# Altium schematic sheet powersupply.SchDoc
size A4
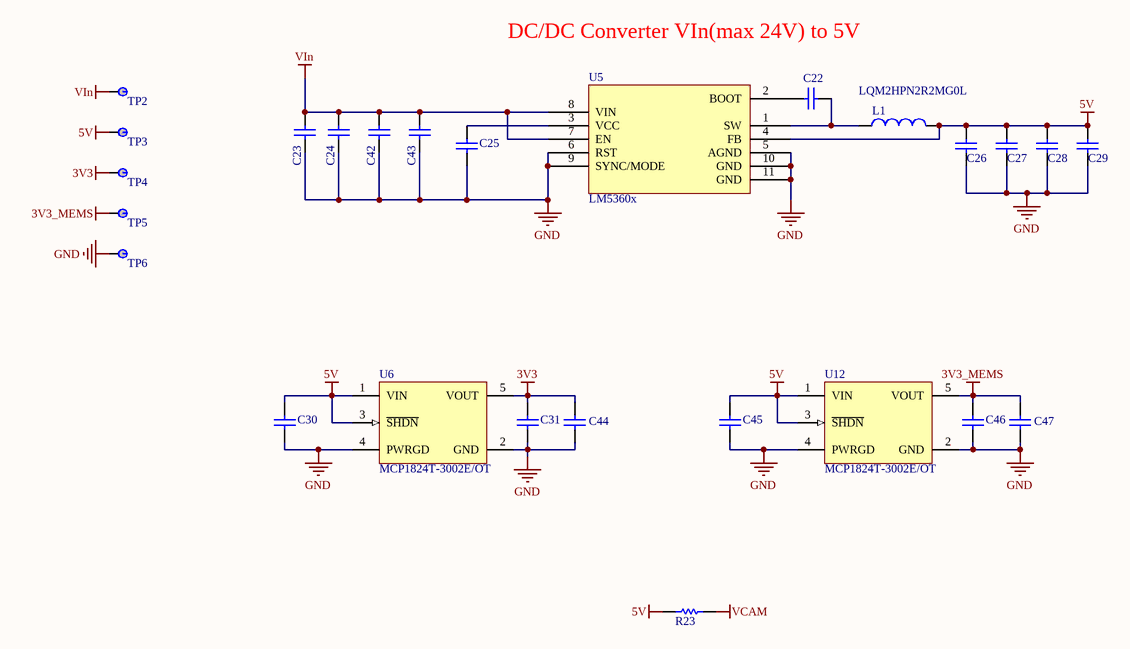
[diagram p0: powersupply.SchDoc]

## Parts
C22  CAP 100nF 50V 0805(2012)  [CAPC0805(2012)100_M]  (value not drawn)
C23  CAP 4.7uF 50V 0805(2012)  [CAPC0805(2012)145_M]  (value not drawn)
C24  CAP 100nF 50V 0805(2012)  [CAPC0805(2012)100_M]  (value not drawn)
C25  CAP 1uF 6.3V 0603(1608)  [CAPC0603(1608)100_N]  (value not drawn)
C26  CAP 4.7uF 16V 0603(1608)  [CAPC0603(1608)100_N]  (value not drawn)
C27  CAP 4.7uF 16V 0603(1608)  [CAPC0603(1608)100_N]  (value not drawn)
C28  CAP 4.7uF 16V 0603(1608)  [CAPC0603(1608)100_N]  (value not drawn)
C29  CAP 4.7uF 16V 0603(1608)  [CAPC0603(1608)100_N]  (value not drawn)
C30  CAP 1uF 35V 0603(1608)  [CAPC0603(1608)100_L]  (value not drawn)
C31  CAP 1uF 35V 0603(1608)  [CAPC0603(1608)100_L]  (value not drawn)
C42  CAP 4.7uF 50V 1210(3225)  [CAPC1210(3225)280_L]  (value not drawn)
C43  CAP 4.7uF 50V 1210(3225)  [CAPC1210(3225)280_L]  (value not drawn)
C44  CAP 4.7uF 16V 0603(1608)  [CAPC0603(1608)100_L]  (value not drawn)
C45  CAP 1uF 35V 0603(1608)  [CAPC0603(1608)100_L]  (value not drawn)
C46  CAP 1uF 35V 0603(1608)  [CAPC0603(1608)100_L]  (value not drawn)
C47  CAP 4.7uF 16V 0603(1608)  [CAPC0603(1608)100_L]  (value not drawn)
L1  LQM2HPN2R2MG0L  [INDC2520X100X60ML20T20]
R23  Jumper 1206(3216)  [RESC1206(3216)_L]  (value not drawn)
TP2  Test Point  [TP]  (value not drawn)  (no BOM)
TP3  Test Point  [TP]  (value not drawn)  (no BOM)
TP4  Test Point  [TP]  (value not drawn)  (no BOM)
TP5  Test Point  [TP]  (value not drawn)  (no BOM)
TP6  Test Point  [TP]  (value not drawn)  (no BOM)
U5  LM5360x  [TI WSON-10 SD]
U6  MCP1824T-3002E/OT  [SOT-23-OT5_L]
U12  MCP1824T-3002E/OT  [SOT-23-OT5_L]

## Nets
3V3: C31.2 C44.2 TP4.1 U6.5(VOUT)
3V3_MEMS: C46.2 C47.2 TP5.1 U12.5(VOUT)
5V: C26.2 C27.2 C28.2 C29.2 C30.2 C45.2 L1.2 R23.1 TP3.1 U5.4(FB) U6.1(VIN) U6.3(~{SHDN}) U12.1(VIN) U12.3(~{SHDN})
GND: C23.1 C24.2 C25.1 C26.1 C27.1 C28.1 C29.1 C30.1 C31.1 C42.1 C43.1 C44.1 C45.1 C46.1 C47.1 TP6.1 U5.5(AGND) U5.6(RST) U5.9(SYNC/MODE) U5.10(GND) U5.11(GND) U6.2(GND) U6.4(PWRGD) U12.2(GND) U12.4(PWRGD)
VCAM: R23.2
VIn: C23.2 C24.1 C42.2 C43.2 TP2.1 U5.7(EN) U5.8(VIN)
NetC22_1: C22.1 U5.2(BOOT)
NetC22_2: C22.2 L1.1 U5.1(SW)
NetC25_2: C25.2 U5.3(VCC)

## Notes on the sheet
- DC/DC Converter VIn(max 24V) to 5V

## Library data of the parts
C22 C24 = CMP-1036-04420-1: CAP 100nF 50V ±10% 0805 (2012 Metric) Thickness 1mm SMD; Case-EIA: 0805; Tolerance: Â±10%; Case-Metric: 2012; Rated Voltage: 50 V; Value: 100nF; Max Thickness: 1 mm; Technology: SMT
C23 = CMP-1036-04901-1: CAP 4.7uF 50V ±20% 0805 (2012 Metric) Thickness 1.45mm SMD; Tolerance: Â±20%; Case-Metric: 2012; Case-EIA: 0805; Technology: SMT; Value: 4.7uF; Max Thickness: 1.45 mm; Rated Voltage: 50 V
C25 = CMP-1035-02730-1: CAP 1uF 6.3V ±10% 0603 (1608 Metric) Thickness 1mm SMD; Case-EIA: 0603; Case-Metric: 1608; Tolerance: Â±10%; Rated Voltage: 6.3 V; Max Thickness: 1 mm; Technology: SMT; Value: 1uF
C26-C29 C44 C47 = CMP-1035-02789-1: CAP 4.7uF 16V ±20% 0603 (1608 Metric) Thickness 1mm SMD; Case-EIA: 0603; Tolerance: Â±20%; Case-Metric: 1608; Max Thickness: 1 mm; Rated Voltage: 16 V; Technology: SMT; Value: 4.7uF
C30 C31 C45 C46 = CMP-1035-02743-1: CAP 1uF 35V ±10% 0603 (1608 Metric) Thickness 1mm SMD; Case-Metric: 1608; Case-EIA: 0603; Tolerance: Â±10%; Max Thickness: 1 mm; Value: 1uF; Technology: SMT; Rated Voltage: 35 V
C42 C43 = CMP-1038-02162-1: CAP 4.7uF 50V ±10% 1210 (3225 Metric) Thickness 2.8mm SMD; Case-Metric: 3225; Case-EIA: 1210; Tolerance: Â±10%; Rated Voltage: 50 V; Technology: SMT; Max Thickness: 2.8 mm; Value: 4.7uF
L1 = CMP-1662-00028-1: Chip Inductor, 2.2 uH, +/- 20%, -55 to 125 degC, 1008 (2520 Metric), RoHS, Tape and Reel; Voltage Rating (DC): 50 V; Capacitance: 220 uF; Case\Package: Radial; Lead Pitch: 5 mm; PackageDescription: 2-Pin Surface Mounted Device, Body 2.5 x 2 mm; ComponentLink2URL: http://psearch.en.murata.com/inductor/product/LQM2HPN2R2MG0%23.pdf; Height: 12.5 mm; PackageReference: 1008; Voltage Rating: 50 V; ComponentLink1URL: http://www.murata.com/; Package Quantity: 200; REACH SVHC: No SVHC; ComponentLink1Description: Manufacturer URL; Length: 12.5 mm; Max Operating Temperature: 85 degC; DatasheetVersion: Aug-16; Diameter: 10 mm; RoHSCompliant: true; Packaging: Bulk; Mount: Through Hole; Pins: 2; ComponentLink2Description: Datasheet; Tolerance: 20%; Min Operating Temperature: -40 degC; Radiation Hardening: No
R23 = CMP-1014-00001-1: Jumper 1206 (3216 Metric); Tolerance: None; Case-EIA: 1206; Case-Metric: 3216; Value: 0.00 Ohm; Technology: SMT; Power: None
U6 U12 = CMP-0136-00662-1: 300 mA, Low Voltage, Low Quiescent Current LDO Regulator, 5-Pin SOT-23, Extended Temperature, Tape and Reel; Code_IPC: SOT23-5; PackageDescription: 5-Lead Plastic Small Outline Transistor (OT) [SOT-23]; PackageVersion: revBB, Aug-2009; PackageReference: SOT-23-OT5; DatasheetVersion: revA, Aug-2007